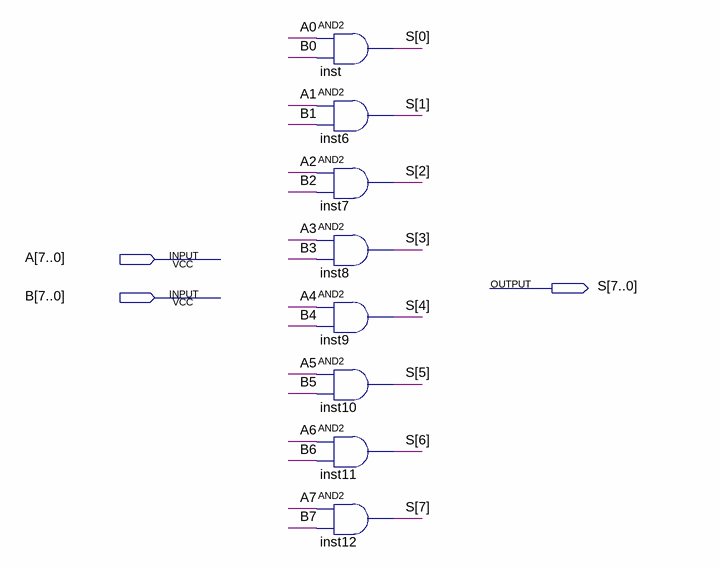
[diagram p0: schematic sheet]
// Quartus schematic AND_neander.bdf as structural Verilog: 8 symbols, 3 pins
module AND_neander (
  input  [7:0] A,
  input  [7:0] B,
  output [7:0] S
);

  and inst (S[0], A[0], B[0]);
  and inst6 (S[1], A[1], B[1]);
  and inst7 (S[2], A[2], B[2]);
  and inst8 (S[3], A[3], B[3]);
  and inst9 (S[4], A[4], B[4]);
  and inst10 (S[5], A[5], B[5]);
  and inst11 (S[6], A[6], B[6]);
  and inst12 (S[7], A[7], B[7]);
endmodule
